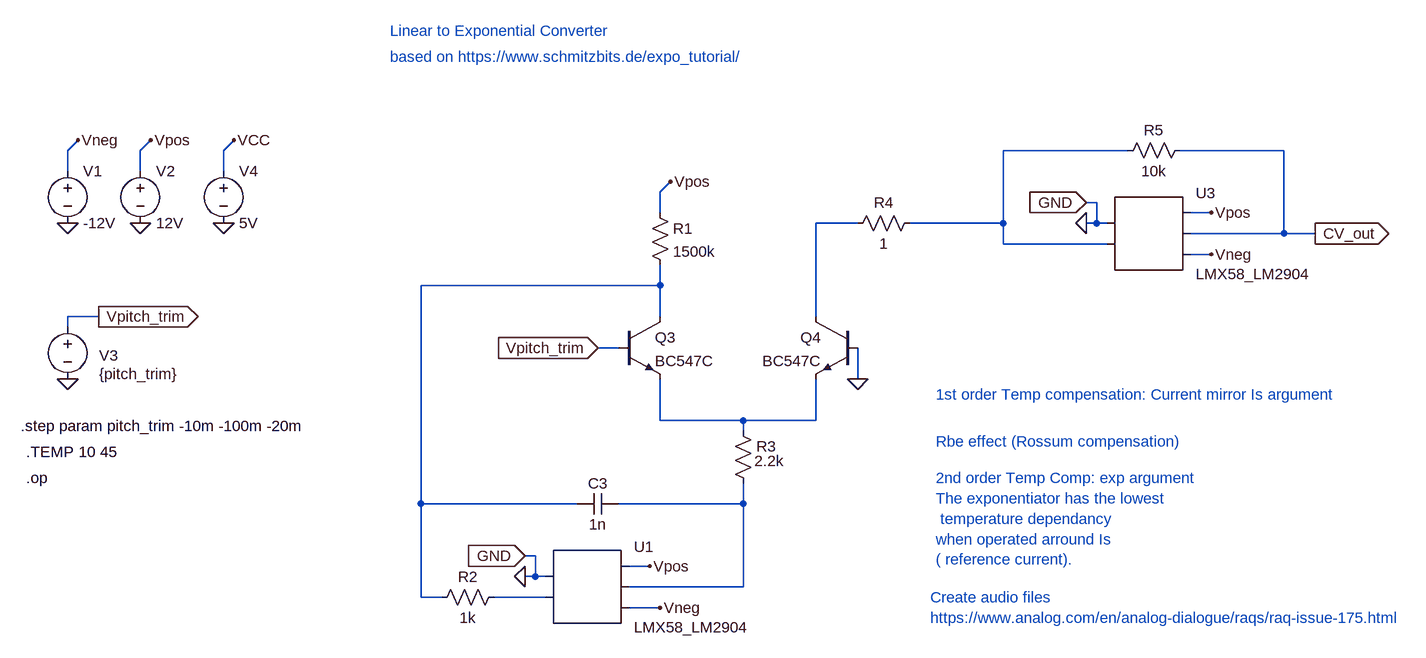
[diagram p0: schematic main_npn_based.asc]
main_npn_based.asc, the LTspice schematic file:
Version 4
SHEET 1 3072 1500
WIRE -1648 -256 -1632 -272
WIRE -1536 -256 -1520 -272
WIRE -1408 -256 -1392 -272
WIRE -16 -256 -208 -256
WIRE 224 -256 64 -256
WIRE -1648 -224 -1648 -256
WIRE -1536 -224 -1536 -256
WIRE -1408 -224 -1408 -256
WIRE -736 -192 -720 -208
WIRE -64 -176 -80 -176
WIRE -736 -160 -736 -192
WIRE 112 -160 80 -160
WIRE -432 -144 -496 -144
WIRE -208 -144 -208 -256
WIRE -208 -144 -352 -144
WIRE -64 -144 -64 -176
WIRE -64 -144 -80 -144
WIRE -48 -144 -64 -144
WIRE 224 -128 224 -256
WIRE 224 -128 80 -128
WIRE 272 -128 224 -128
WIRE -208 -112 -208 -144
WIRE -48 -112 -208 -112
WIRE 112 -96 80 -96
WIRE -736 -48 -736 -80
WIRE -736 -48 -1104 -48
WIRE -1600 0 -1648 0
WIRE -736 0 -736 -48
WIRE -496 0 -496 -144
WIRE -1648 16 -1648 0
WIRE -800 48 -832 48
WIRE -432 96 -432 48
WIRE -736 160 -736 96
WIRE -608 160 -736 160
WIRE -496 160 -496 96
WIRE -496 160 -608 160
WIRE -608 176 -608 160
WIRE -1104 288 -1104 -48
WIRE -864 288 -1104 288
WIRE -608 288 -608 256
WIRE -608 288 -800 288
WIRE -928 368 -944 368
WIRE -752 384 -784 384
WIRE -928 400 -928 368
WIRE -928 400 -944 400
WIRE -912 400 -928 400
WIRE -608 416 -608 288
WIRE -608 416 -784 416
WIRE -1104 432 -1104 288
WIRE -1072 432 -1104 432
WIRE -912 432 -992 432
WIRE -736 448 -784 448
FLAG -1648 -144 0
FLAG -1536 -144 0
FLAG -1648 96 0
FLAG -1632 -272 Vneg
FLAG -1520 -272 Vpos
FLAG -1408 -144 0
FLAG -1392 -272 VCC
FLAG -1600 0 Vpitch_trim
IOPIN -1600 0 Out
FLAG -944 368 GND
IOPIN -944 368 In
FLAG -944 400 0
FLAG -736 448 Vneg
FLAG -752 384 Vpos
FLAG -832 48 Vpitch_trim
IOPIN -832 48 In
FLAG -432 96 0
FLAG 112 -96 Vneg
FLAG 112 -160 Vpos
FLAG -80 -176 GND
IOPIN -80 -176 In
FLAG -80 -144 0
FLAG 272 -128 CV_out
IOPIN 272 -128 Out
FLAG -720 -208 Vpos
SYMBOL voltage -1648 -240 R0
WINDOW 123 0 0 Left 0
WINDOW 39 0 0 Left 0
SYMATTR InstName V1
SYMATTR Value -12V
SYMBOL voltage -1536 -240 R0
WINDOW 123 0 0 Left 0
WINDOW 39 0 0 Left 0
SYMATTR InstName V2
SYMATTR Value 12V
SYMBOL voltage -1648 0 R0
WINDOW 0 49 60 Left 2
WINDOW 3 49 88 Left 2
WINDOW 123 0 0 Left 0
WINDOW 39 0 0 Left 0
SYMATTR InstName V3
SYMATTR Value {pitch_trim}
SYMBOL voltage -1408 -240 R0
WINDOW 123 0 0 Left 0
WINDOW 39 0 0 Left 0
SYMATTR InstName V4
SYMATTR Value 5V
SYMBOL AutoGenerated\\LMX58_LM2904 -848 416 R0
SYMATTR InstName U1
SYMBOL res -624 160 R0
WINDOW 3 33 62 Left 2
SYMATTR Value 2.2k
SYMATTR InstName R3
SYMBOL cap -800 272 R90
WINDOW 0 0 32 VBottom 2
WINDOW 3 32 32 VTop 2
SYMATTR InstName C3
SYMATTR Value 1n
SYMBOL npn -800 0 R0
SYMATTR InstName Q3
SYMATTR Value BC547C
SYMBOL npn -432 0 M0
SYMATTR InstName Q4
SYMATTR Value BC547C
SYMBOL res -752 -176 R0
SYMATTR InstName R1
SYMATTR Value 1500k
SYMBOL AutoGenerated\\LMX58_LM2904 16 -128 R0
SYMATTR InstName U3
SYMBOL res -976 416 R90
WINDOW 0 0 56 VBottom 2
WINDOW 3 32 56 VTop 2
SYMATTR InstName R2
SYMATTR Value 1k
SYMBOL res 80 -272 R90
WINDOW 0 0 56 VBottom 2
WINDOW 3 32 56 VTop 2
SYMATTR InstName R5
SYMATTR Value 10k
SYMBOL res -336 -160 R90
WINDOW 0 0 56 VBottom 2
WINDOW 3 32 56 VTop 2
SYMATTR InstName R4
SYMATTR Value 1
TEXT -1152 -400 Left 2 ;based on https://www.schmitzbits.de/expo_tutorial/
TEXT -320 432 Left 2 ;Create audio files\nhttps://www.analog.com/en/analog-dialogue/raqs/raq-issue-175.html
TEXT -1720 168 Left 2 !.step param pitch_trim -10m -100m -20m
TEXT -1712 208 Left 2 !.TEMP 10 45
TEXT -1712 248 Left 2 !.op
TEXT -1152 -440 Left 2 ;Linear to Exponential Converter
TEXT -312 120 Left 2 ;1st order Temp compensation: Current mirror Is argument
TEXT -312 280 Left 2 ;The exponentiator has the lowest\n temperature dependancy\nwhen operated arround Is\n( reference current).
TEXT -312 248 Left 2 ;2nd order Temp Comp: exp argument
TEXT -312 192 Left 2 ;Rbe effect (Rossum compensation)

The netlist it stands for:
* main_npn_based.asc
V1 Vneg 0 -12V
V2 Vpos 0 12V
V3 Vpitch_trim 0 {pitch_trim}
V4 VCC 0 5V
* U1: LMX58_LM2904 (symbol AutoGenerated\LMX58_LM2904 not available, pins judged from their places): pin1=0 pin2=N006 pin3=Vpos pin4=N005 pin5=Vneg
R3 N004 N005 2.2k
C3 N005 N003 1n
Q3 N003 Vpitch_trim N004 0 BC547C
Q4 N002 0 N004 0 BC547C
R1 Vpos N003 1500k
* U3: LMX58_LM2904 (symbol AutoGenerated\LMX58_LM2904 not available, pins judged from their places): pin1=0 pin2=N001 pin3=Vpos pin4=CV_out pin5=Vneg
R2 N006 N003 1k
R5 CV_out N001 10k
R4 N001 N002 1
.model NPN NPN
.model PNP PNP
.lib standard.bjt
* based on https://www.schmitzbits.de/expo_tutorial/
* Create audio files
* https://www.analog.com/en/analog-dialogue/raqs/raq-issue-175.html
.step param pitch_trim -10m -100m -20m
.TEMP 10 45
.op
* Linear to Exponential Converter
* 1st order Temp compensation: Current mirror Is argument
* The exponentiator has the lowest
*  temperature dependancy
* when operated arround Is
* ( reference current).
* 2nd order Temp Comp: exp argument
* Rbe effect (Rossum compensation)
.backanno
.end